# Altium project SmartStepper_21_r1.0.PrjPcb
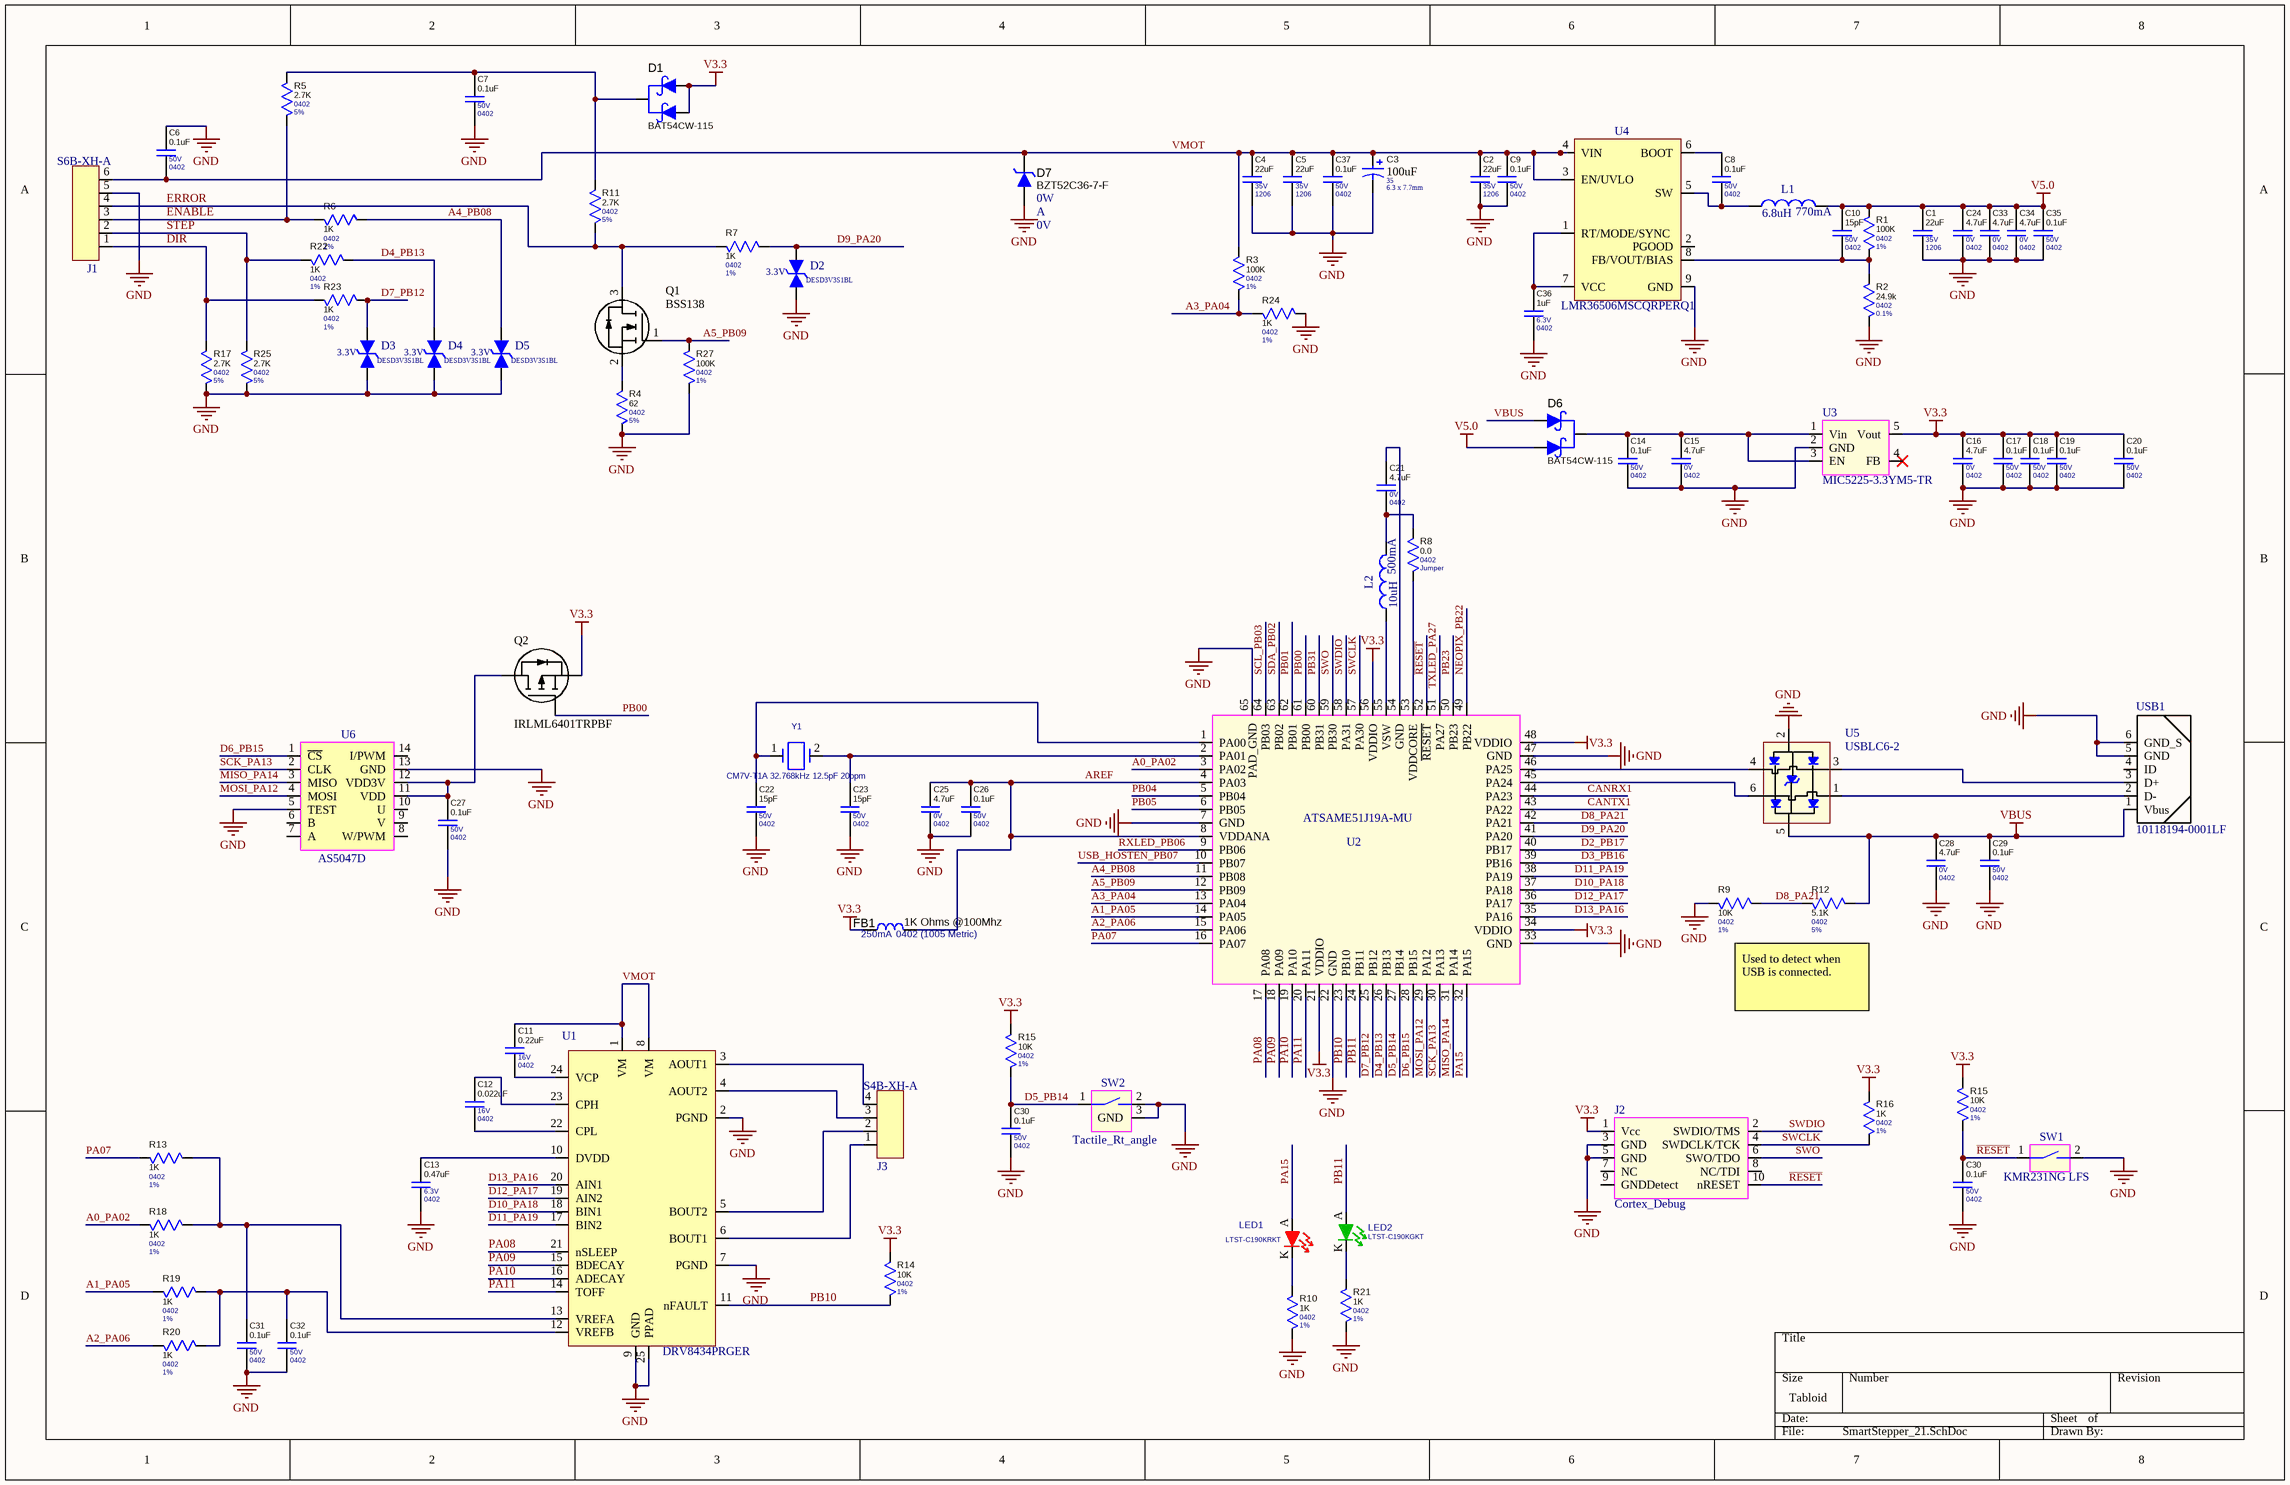
[diagram p0: SmartStepper_21.SchDoc]
1 sheet, 92 parts. Net scope: global (net labels, ports and power ports of the same name join across sheets).
Board files: SmartStepper_21_r1.0.PcbDoc, panel.PcbDoc

## Sheet SmartStepper_21.SchDoc
size Tabloid; PageSetup: Record=PageOptions|CenterHorizontal=True|CenterVertical=True|PrintScale=0.98|XCorrection=1.00|YCorrection=1.00|PrintKind=0|BorderSize=5000000|LeftOffset=0|BottomOffset=0|Orientation=2|PaperLength=1000|PaperWidth=1000|Scale=100|PaperSource=7|PrintQuality=-3|MediaType=1|DitherType=10|PrintScaleMode=1|PaperKind=Tabloid|PaperIndex=3

### Parts
(Parts that share a designator on the sheet are numbered #1, #2 ... from top to bottom, then left to right.)
C1  22uF  Size_Imperial: 1206  Voltage_Str: 35V  [CAP_1206_H]
C2  22uF  Size_Imperial: 1206  Voltage_Str: 35V  [CAP_1206_H]
C3  Size: 6.3 x 7.7mm  Voltage: 35  [UWT1V101MCL1GS]  (hidden comment: 100uF)
C4  22uF  Size_Imperial: 1206  Voltage_Str: 35V  [CAP_1206_H]
C5  22uF  Size_Imperial: 1206  Voltage_Str: 35V  [CAP_1206_H]
C6  0.1uF  Size_Imperial: 0402  Voltage_Str: 50V  [CAP_0402_H]
C7  0.1uF  Size_Imperial: 0402  Voltage_Str: 50V  [CAP_0402_H]
C8  0.1uF  Size_Imperial: 0402  Voltage_Str: 50V  [CAP_0402_H]
C9  0.1uF  Size_Imperial: 0402  Voltage_Str: 50V  [CAP_0402_H]
C10  15pF  Size_Imperial: 0402  Voltage_Str: 50V  [CAP_0402_H]
C11  0.22uF  Size_Imperial: 0402  Voltage_Str: 16V  [CAP_0402_H]
C12  0.022uF  Size_Imperial: 0402  Voltage_Str: 16V  [CAP_0402_H]
C13  0.47uF  Size_Imperial: 0402  Voltage_Str: 6.3V  [CAP_0402_H]
C14  0.1uF  Size_Imperial: 0402  Voltage_Str: 50V  [CAP_0402_H]
C15  4.7uF  Size_Imperial: 0402  Voltage_Str: 0V  [CAP_0402_H]
C16  4.7uF  Size_Imperial: 0402  Voltage_Str: 0V  [CAP_0402_H]
C17  0.1uF  Size_Imperial: 0402  Voltage_Str: 50V  [CAP_0402_H]
C18  0.1uF  Size_Imperial: 0402  Voltage_Str: 50V  [CAP_0402_H]
C19  0.1uF  Size_Imperial: 0402  Voltage_Str: 50V  [CAP_0402_H]
C20  0.1uF  Size_Imperial: 0402  Voltage_Str: 50V  [CAP_0402_H]
C21  4.7uF  Size_Imperial: 0402  Voltage_Str: 0V  [CAP_0402_H]
C22  15pF  Size_Imperial: 0402  Voltage_Str: 50V  [CAP_0402_H]
C23  15pF  Size_Imperial: 0402  Voltage_Str: 50V  [CAP_0402_H]
C24  4.7uF  Size_Imperial: 0402  Voltage_Str: 0V  [CAP_0402_H]
C25  4.7uF  Size_Imperial: 0402  Voltage_Str: 0V  [CAP_0402_H]
C26  0.1uF  Size_Imperial: 0402  Voltage_Str: 50V  [CAP_0402_H]
C27  0.1uF  Size_Imperial: 0402  Voltage_Str: 50V  [CAP_0402_H]
C28  4.7uF  Size_Imperial: 0402  Voltage_Str: 0V  [CAP_0402_H]
C29  0.1uF  Size_Imperial: 0402  Voltage_Str: 50V  [CAP_0402_H]
C30#1  0.1uF  Size_Imperial: 0402  Voltage_Str: 50V  [CAP_0402_H]
C30#2  0.1uF  Size_Imperial: 0402  Voltage_Str: 50V  [CAP_0402_H]
C31  0.1uF  Size_Imperial: 0402  Voltage_Str: 50V  [CAP_0402_H]
C32  0.1uF  Size_Imperial: 0402  Voltage_Str: 50V  [CAP_0402_H]
C33  4.7uF  Size_Imperial: 0402  Voltage_Str: 0V  [CAP_0402_H]
C34  4.7uF  Size_Imperial: 0402  Voltage_Str: 0V  [CAP_0402_H]
C35  0.1uF  Size_Imperial: 0402  Voltage_Str: 50V  [CAP_0402_H]
C36  1uF  Size_Imperial: 0402  Voltage_Str: 6.3V  [CAP_0402_H]
C37  0.1uF  Size_Imperial: 0402  Voltage_Str: 50V  [CAP_0402_H]
D1  BAT54CW-115  [BAT54CW-115]
D2  DESD3V3S1BL  [DESD3V3S1BL]
D3  DESD3V3S1BL  [DESD3V3S1BL]
D4  DESD3V3S1BL  [DESD3V3S1BL]
D5  DESD3V3S1BL  [DESD3V3S1BL]
D6  BAT54CW-115  [BAT54CW-115]
D7  BZT52C36-7-F  Watts_str: 0W  current: A  voltage_str: 0V  [BZT52C36-7-F]
FB1  1K Ohms @100Mhz  Size: 0402 (1005 Metric)  current: 250mA  [IND_0402_H]
J1  S6B-XH-A  [S6B-XH-A]
J2  Cortex_Debug  [FTSH-105-01-L-D]
J3  S4B-XH-A  [S4B-XH-A]
L1  6.8uH  Current: 770mA  [IND_1210_H]
L2  10uH  Current: 500mA  [IND_0805_H]
LED1  LTST-C190KRKT  [LTST-C190KRKT]
LED2  LTST-C190KGKT  [LTST-C190KGKT]
Q1  BSS138  [BSS138]
Q2  IRLML6401TRPBF  [IRLML6401TRPBF_M]
R1  100K  Size_Imperial: 0402  Tolerance: 1%  [RES_0402_H]
R2  24.9k  Size_Imperial: 0402  Tolerance: 0.1%  [RES_0402_H]
R3  100K  Size_Imperial: 0402  Tolerance: 1%  [RES_0402_H]
R4  62  Size_Imperial: 0402  Tolerance: 5%  [RES_0402_H]
R5  2.7K  Size_Imperial: 0402  Tolerance: 5%  [RES_0402_H]
R6  1K  Size_Imperial: 0402  Tolerance: 1%  [RES_0402_H]
R7  1K  Size_Imperial: 0402  Tolerance: 1%  [RES_0402_H]
R8  0.0  Size_Imperial: 0402  Tolerance: Jumper  [RES_0402_H]
R9  10K  Size_Imperial: 0402  Tolerance: 1%  [RES_0402_H]
R10  1K  Size_Imperial: 0402  Tolerance: 1%  [RES_0402_H]
R11  2.7K  Size_Imperial: 0402  Tolerance: 5%  [RES_0402_H]
R12  5.1K  Size_Imperial: 0402  Tolerance: 5%  [RES_0402_H]
R13  1K  Size_Imperial: 0402  Tolerance: 1%  [RES_0402_H]
R14  10K  Size_Imperial: 0402  Tolerance: 1%  [RES_0402_H]
R15#1  10K  Size_Imperial: 0402  Tolerance: 1%  [RES_0402_H]
R15#2  10K  Size_Imperial: 0402  Tolerance: 1%  [RES_0402_H]
R16  1K  Size_Imperial: 0402  Tolerance: 1%  [RES_0402_H]
R17  2.7K  Size_Imperial: 0402  Tolerance: 5%  [RES_0402_H]
R18  1K  Size_Imperial: 0402  Tolerance: 1%  [RES_0402_H]
R19  1K  Size_Imperial: 0402  Tolerance: 1%  [RES_0402_H]
R20  1K  Size_Imperial: 0402  Tolerance: 1%  [RES_0402_H]
R21  1K  Size_Imperial: 0402  Tolerance: 1%  [RES_0402_H]
R22  1K  Size_Imperial: 0402  Tolerance: 1%  [RES_0402_H]
R23  1K  Size_Imperial: 0402  Tolerance: 1%  [RES_0402_H]
R24  1K  Size_Imperial: 0402  Tolerance: 1%  [RES_0402_H]
R25  2.7K  Size_Imperial: 0402  Tolerance: 5%  [RES_0402_H]
R27  100K  Size_Imperial: 0402  Tolerance: 1%  [RES_0402_H]
SW1  KMR231NG LFS  [KMR231NG_LFS]
SW2  Tactile_Rt_angle  [Tactile_Rt_angle]
U1  DRV8434PRGER  [DRV8434PRGER]
U2  ATSAME51J19A-MU  [ATSAME51J19A-MU]
U3  MIC5225-3.3YM5-TR  [MIC5225-3.3YM5-TR]
U4  LMR36506MSCQRPERQ1  [LMR36506MSCQRPERQ1]
U5  USBLC6-2  [USBLC6-2SC6]
U6  AS5047D  [AS5047D]
USB1  10118194-0001LF  [10118194-0001LF]
Y1  CM7V-T1A 32.768kHz 12.5pF 20ppm  [FC-135-32.7680KA-A3]

### Nets
GND: C1.2 C2.2 C3.2(Neg) C4.2 C5.2 C6.1 C7.2 C9.2 C13.2 C14.2 C15.2 C16.2 C17.2 C18.2 C19.2 C20.2 C22.2 C23.2 C24.2 C25.2 C26.2 C27.2 C28.2 C29.2 C30#1.2 C30#2.2 C31.2 C32.2 C33.2 C34.2 C35.2 C36.2 C37.2 D2.1 D3.1 D4.1 D5.1 D7.A J1.5 J2.3(GND) J2.5(GND) R2.1 R4.1 R9.1 R10.1 R17.1 R21.1 R24.2 R25.1 R27.1 SW1.2 SW2.2 SW2.3(GND) U1.2(PGND) U1.7(PGND) U1.9(GND) U1.25(PPAD) U2.7(GND) U2.22(GND) U2.33(GND) U2.47(GND) U2.65(PAD_GND) U3.2(GND) U4.9(GND) U5.2(GND) U6.5(TEST) U6.13(GND) USB1.5(GND) USB1.6(GND_S)
V3.3: C16.1 C17.1 C18.1 C19.1 C20.1 D1.1 D1.2 FB1.1 J2.1(Vcc) Q2.2 R14.1 R15#1.2 R15#2.2 R16.2 U2.21(VDDIO) U2.34(VDDIO) U2.48(VDDIO) U2.56(VDDIO) U3.5(Vout)
V5.0: C1.1 C10.1 C24.1 C33.1 C34.1 C35.1 D6.2 L1.2 R1.2
VBUS: C28.1 C29.1 D6.1 R12.2 U5.5(VBUS) USB1.1(Vbus)
~{RESET}: C30#2.1 J2.10(nRESET) R15#2.1 SW1.1 U2.52(~{RESET})
A0_PA02: R18.1 U2.3(PA02)
A1_PA05: R19.1 U2.14(PA05)
A2_PA06: R20.1 U2.15(PA06)
A3_PA04: R3.1 R24.1 U2.13(PA04)
A4_PB08: D5.2 R6.2 U2.11(PB08)
A5_PB09: Q1.1 R27.2 U2.12(PB09)
AREF: C25.1 C26.1 FB1.2 U2.4(PA03) U2.8(VDDANA)
CANRX1: U2.44(PA23)
CANTX1: U2.43(PA22)
D2_PB17: U2.40(PB17)
D3_PB16: U2.39(PB16)
D4_PB13: D4.2 R22.2 U2.26(PB13)
D5_PB14: C30#1.1 R15#1.1 SW2.1 U2.27(PB14)
D6_PB15: U2.28(PB15) U6.1(~{CS})
D7_PB12: D3.2 R23.2 U2.25(PB12)
D8_PA21: R9.2 R12.1 U2.42(PA21)
D9_PA20: D2.2 R7.2 U2.41(PA20)
D10_PA18: U1.18(BIN1) U2.37(PA18)
D11_PA19: U1.17(BIN2) U2.38(PA19)
D12_PA17: U1.19(AIN2) U2.36(PA17)
D13_PA16: U1.20(AIN1) U2.35(PA16)
DIR: J1.1 R17.2 R23.1
ENABLE: J1.3 R5.1 R6.1
ERROR: J1.4 Q1.3 R7.1 R11.1
MISO_PA14: U2.31(PA14) U6.3(MISO)
MOSI_PA12: U2.29(PA12) U6.4(MOSI)
NEOPIX_PB22: U2.49(PB22)
PA07: R13.1 U2.16(PA07)
PA08: U1.21(nSLEEP) U2.17(PA08)
PA09: U1.15(BDECAY) U2.18(PA09)
PA10: U1.16(ADECAY) U2.19(PA10)
PA11: U1.14(TOFF) U2.20(PA11)
PA15: LED1.A U2.32(PA15)
PB00: Q2.1 U2.61(PB00)
PB01: U2.62(PB01)
PB04: U2.5(PB04)
PB05: U2.6(PB05)
PB10: R14.2 U1.11(nFAULT) U2.23(PB10)
PB11: LED2.A U2.24(PB11)
PB23: U2.50(PB23)
PB31: U2.60(PB31)
RXLED_PB06: U2.9(PB06)
SCK_PA13: U2.30(PA13) U6.2(CLK)
SCL_PB03: U2.64(PB03)
SDA_PB02: U2.63(PB02)
STEP: J1.2 R22.1 R25.2
SWCLK: J2.4(SWDCLK/TCK) R16.1 U2.57(PA30)
SWDIO: J2.2(SWDIO/TMS) U2.58(PA31)
SWO: J2.6(SWO/TDO) U2.59(PB30)
TXLED_PA27: U2.51(PA27)
USB_HOSTEN_PB07: U2.10(PB07)
VMOT: C2.1 C3.1(Pos) C4.1 C5.1 C6.2 C9.1 C11.1 C37.1 D7.K J1.6 R3.2 U1.1(VM) U1.8(VM) U4.3(EN/UVLO) U4.4(VIN)
NetC7_1: C7.1 D1.3 R5.2 R11.2
NetC8_1: C8.1 U4.6(BOOT)
NetC8_2: C8.2 L1.1 U4.5(SW)
NetC10_2: C10.2 R1.1 R2.2 U4.8(FB/VOUT/BIAS)
NetC11_2: C11.2 U1.24(VCP)
NetC12_1: C12.1 U1.23(CPH)
NetC12_2: C12.2 U1.22(CPL)
NetC13_1: C13.1 U1.10(DVDD)
NetC14_1: C14.1 C15.1 D6.3 U3.1(Vin) U3.3(EN)
NetC21_1: C21.1 U2.54(GND)
NetC21_2: C21.2 L2.2 R8.2
NetC22_1: C22.1 U2.1(PA00) Y1.1(A)
NetC23_1: C23.1 U2.2(PA01) Y1.2(B)
NetC27_1: C27.1 Q2.3 U6.11(VDD) U6.12(VDD3V)
NetC31_1: C31.1 R13.2 R18.2 U1.13(VREFA)
NetC32_1: C32.1 R19.2 R20.2 U1.12(VREFB)
NetC36_1: C36.1 U4.1(RT/MODE/SYNC) U4.7(VCC)
NetJ3_1: J3.1 U1.6(BOUT1)
NetJ3_2: J3.2 U1.5(BOUT2)
NetJ3_3: J3.3 U1.4(AOUT2)
NetJ3_4: J3.4 U1.3(AOUT1)
NetL2_1: L2.1 U2.55(VSW)
NetLED1_K: LED1.K R10.2
NetLED2_K: LED2.K R21.2
NetQ1_2: Q1.2 R4.2
NetR8_1: R8.1 U2.53(VDDCORE)
NetU2_45: U2.45(PA24) U5.6(IO1)
NetU2_46: U2.46(PA25) U5.4(IO2)
NetU5_1: U5.1(IO1) USB1.2(D-)
NetU5_3: U5.3(IO2) USB1.3(D+)

Not connected (* = marked no-connect by the designer): J2 7(NC) 8(NC/TDI) 9(GNDDetect); U3 4(FB)*; U4 2(PGOOD); U6 6(B) 7(A) 8(W/PWM) 9(V) 10(U) 14(I/PWM); USB1 4(ID)

### Notes on the sheet
- Used to detect when USB is connected.
- (in symbol altiumdb561d376dcaa1e7.492460921) 3.3V

### Library data of the parts
C1 C2 C4 C5 = altiumdb4f4e676cee2d25.37975462: CAP CER 22UF 35V 20% X5R 1206; Manufacturer: TDK Corporation; Manufacture_Parts: TDK Corporation:C3216X5R1V226M; Vendor_Part_Number: 445-8045-1-ND; ID: 16; Farad: 2.2E-5; Operating_Temp: -55Â°C ~ 85Â°C; Component: C3216X5R1V226M; Misfit Price: 0; Vendor: Digikey; Vendor_Qty_Avail: 5703; High_Price: 0.319; Low_Price: 0.267; Size_Metric: 3216; Watts_Str: 0W; Current_Str: A; Vendor_Unit_Price: 1.24; Vendor_Packaging: Cut Tape (CT); Value: 22uF; Company_Part_GUID: altiumdb4f4e676cee2d25.37975462; Voltage: 35V; Size: 1206 (3216 Metric); Tolerance: 20%; Temp_Coeff: X5R; Manufacturer_Part_Number: C3216X5R1V226M; Created_Date: 2/29/2012; ComponentLink1Description: Digikey; ComponentLink2Description: Datasheet; ComponentLink1URL: http://search.digikey.com/us/en/products/C3216X5R1V226M/445-8045-1-ND/2792165; ComponentLink2URL: http://www.tdk.com/pdf/general_B11.pdf; Vendor_Part_URL: http://search.digikey.com/us/en/products/C3216X5R1V226M/445-8045-1-ND/2792165; Vendor_Update_Date: 4/26/2012; Watts: 0; Price: 0.267; Vendor_Part_GUID: altiumdb4f4e675de96ab8.73927878
C3 = altiumdb57a880e8344183.38641875: 100uF 35V SMD; Manufacture_Parts: :UWT1V101MCL1GS; ID: 15; Farad: 0; Tolerance: 20%; Vendor: unknown; Watts_Str: 0W; Current_Str: A; value: 100uF; Company_Part_GUID: altiumdb57a880e8344183.38641875; Component: UWT1V101MCL1GS; Manufacturer_Part_Number: UWT1V101MCL1GS; ComponentLink1Description: unknown; ComponentLink2Description: Datasheet; Misfit Price: 0; Size_Imperial: 6.3 x 7.7mm; Size_Metric: 6.3 x 7.7mm; Voltage_Str: 35V; Watts: 0; Price: 0
C6-C9 C14 C17-C20 C26 C27 C29 C30#1 C30#2 C31 C32 C35 C37 = altiumdb4f04b43ed29fe8.21172567: CAP CER 0.1UF 50V 10% X7R 0402; Manufacturer: TDK Corporation; Misfit Part Number: 00012-001-06580; Manufacture_Parts: TDK Corporation:CGA2B3X7R1H104K; Vendor_Part_Number: 445-6899-2-ND; ID: 75; Voltage: 50; Farad: 1E-7; Operating_Temp: -55Â°C ~ 125Â°C; Component: CGA2B3X7R1H104K; Misfit Price: 0; Vendor: Digikey; Vendor_Qty_Avail: 10000; High_Price: 0.022; Low_Price: 0.015; Size_Metric: 1005; Watts_Str: 0W; Current_Str: A; Vendor_Unit_Price: 0.16; Value: 0.1uF; Company_Part_GUID: altiumdb4f04b43ed29fe8.21172567; Size: 0402 (1005 Metric); Tolerance: 10%; Temp_Coeff: X7R; Manufacturer_Part_Number: CGA2B3X7R1H104K; Created_Date: 1/4/2012; ComponentLink1Description: Digikey; ComponentLink2Description: Datasheet; ComponentLink1URL: http://search.digikey.com/us/en/products/CGA2B3X7R1H104K/445-6899-2-ND/2672792; ComponentLink2URL: http://www.tdk.com/pdf/automotive_B11.pdf; Vendor_Part_URL: http://search.digikey.com/us/en/products/CGA2B3X7R1H104K/445-6899-2-ND/2672792; Vendor_Update_Date: 1/4/2012; Watts: 0; Price: 0.015
C10 C22 C23 = altiumdb4ee8ad945622b4.06854484: CAP 0402 CER 15PF 50V C0G 5%; Manufacturer_Part_Number: C0402C150J5GACTU; Manufacturer: Kemet; Misfit Part Number: 00012-001-06515; Old Part Number: 5110-0201-00; Manufacture_Parts: AVX:04025A150JAT2A / VISHAY:VJ0402A150JXACW1BC / Kemet:C0402C150J5GACTU; Vendor_Part_Number: 399-1014-1-ND; ID: 21; Voltage: 50; Farad: 1.5E-11; Temp_Coeff: C0G (NP0); Operating_Temp: - 55 C to + 125 C; Component: 04025A150JAT2A; Misfit Price: 0; Vendor: Digikey; Vendor_Qty_Avail: 182357; High_Price: 0.12; Low_Price: 0.013; Size_Metric: 1005; Watts_Str: W; Current_Str: A; Vendor_Unit_Price: 0.04; Value: 15pF; Company_Part_GUID: altiumdb4ee8ad945622b4.06854484; Size: 0402 (1005 metric); Tolerance: 5 %; Created_Date: 12/14/2011; ComponentLink1Description: Mouser; ComponentLink2Description: Datasheet; ComponentLink1URL: http://search.digikey.com/us/en/products/C0402C150J5GACTU/399-1014-1-ND/411289; ComponentLink2URL: http://www.avx.com/docs/Catalogs/ccog.pdf; Vendor_Part_URL: http://search.digikey.com/us/en/products/C0402C150J5GACTU/399-1014-1-ND/411289; Vendor_Update_Date: 4/26/2012; Price: 0.013
C11 = altiumdb4ee8ae3ea498a8.40726587: CAP 0402 CER 220NF 16V X7R 10%; Manufacturer_Part_Number: C1005X7R1C224K; Manufacturer: TDK Corporation; Misfit Part Number: 00012-001-06517; Manufacture_Parts: Murata Electronics North America:GRM155R71C224KA12D / TDK Corporation:C1005X7R1C224K; Vendor_Part_Number: 445-5936-1-ND; ID: 36; Voltage: 16; Farad: 2.2E-7; Operating_Temp: -55Â°C ~ 125Â°C; Component: GRM155R71C224KA12D; Misfit Price: 0; Vendor: Digikey; Vendor_Qty_Avail: 67449; High_Price: 0.015; Low_Price: 0.01; Size_Metric: 1005; Watts_Str: W; Current_Str: A; Vendor_Unit_Price: 0.15; Value: 0.22uF; Company_Part_GUID: altiumdb4ee8ae3ea498a8.40726587; Size: 0402 (1005 Metric); Tolerance: 10%; Temp_Coeff: X7R; Created_Date: 12/14/2011; ComponentLink1Description: Digikey; ComponentLink2Description: Datasheet; ComponentLink1URL: http://search.digikey.com/us/en/products/C1005X7R1C224K/445-5936-1-ND/2443976; ComponentLink2URL: http://search.murata.co.jp/Ceramy/image/img/PDF/ENG/GRM155R71C224KA12.pdf; Vendor_Part_URL: http://search.digikey.com/us/en/products/C1005X7R1C224K/445-5936-1-ND/2443976; Vendor_Update_Date: 4/26/2012; Price: 0.01
C12 = altiumdb4ee8ac51866a41.07748777: CAP 0402 CER .022UF 16V X7R 10%; Manufacturer_Part_Number: C0402C223K4RACTU; Manufacturer: Kemet; Misfit Part Number: 00012-001-06365; Manufacture_Parts: AVX:0402YC223KAT2A / Kemet:C0402C223K4RACTU / Murata Electronics North America:GRM155R71C223KA01D / Panasonic - ECG:ECJ-0EF1E223Z; Vendor_Part_Number: 399-3518-1-ND; ID: 1; Voltage: 16; Farad: 2.2E-8; Operating_Temp: - 55 C to + 125 C; Component: 0402YC223KAT2A; Misfit Price: 0; Vendor: Digikey; Vendor_Qty_Avail: 25844; High_Price: 0.2; Low_Price: 0.018; Size_Metric: 1005; Watts_Str: W; Current_Str: A; Vendor_Unit_Price: 0.37; Value: 0.022uF; Company_Part_GUID: altiumdb4ee8ac51866a41.07748777; Size: 0402 (1005 metric); Tolerance: 10 %; Temp_Coeff: X7R; Created_Date: 12/14/2011; ComponentLink1Description: Mouser; ComponentLink2Description: Datasheet; ComponentLink1URL: http://search.digikey.com/us/en/products/C0402C223K4RACTU/399-3518-1-ND/789658; ComponentLink2URL: http://avx.com/docs/Catalogs/cx7r.pdf; Vendor_Part_URL: http://search.digikey.com/us/en/products/C0402C223K4RACTU/399-3518-1-ND/789658; Vendor_Update_Date: 4/26/2012; Price: 0.018
C13 = altiumdb4ee8aefd8a9d96.75333611: CAP 0402 CER 470NF 6.3V X5R 10%; Manufacturer: Kemet; Misfit Part Number: 00012-001-06393; Manufacture_Parts: Kemet:C0402C474K9PACTU / AVX:04026D474KAT2A / Murata:GRM155R60J474KE19D; Vendor_Part_Number: 399-4899-2-ND; ID: 59; Voltage: 6.3; Farad: 4.7E-7; Operating_Temp: -55Â°C ~ 85Â°C; Component: C0402C474K9PACTU; Misfit Price: 0; Vendor: Digikey; Vendor_Qty_Avail: 50000; High_Price: 0.018; Low_Price: 0.01227; Size_Metric: 1005; Watts_Str: 0W; Current_Str: A; Vendor_Unit_Price: 0.17; Value: 0.47uF; Company_Part_GUID: altiumdb4ee8aefd8a9d96.75333611; Size: 0402 (1005 Metric); Tolerance: 10%; Temp_Coeff: X5R; Manufacturer_Part_Number: C0402C474K9PACTU; Created_Date: 12/14/2011; ComponentLink1Description: Digikey; ComponentLink2Description: Datasheet; ComponentLink1URL: http://search.digikey.com/us/en/products/GRM155R60J474KE19D/490-3266-2-ND/702530; ComponentLink2URL: http://search.murata.co.jp/Ceramy/image/img/PDF/ENG/GRM155R60J474KE19.pdf; Vendor_Part_URL: http://search.digikey.com/us/en/products/C0402C474K9PACTU/399-4899-2-ND/1090804; Vendor_Update_Date: 12/14/2011; Watts: 0; Price: 0.01227
C15 C16 C21 C24 C25 C28 C33 C34 = altiumdb4ee8aef7c8e199.98927270: CAP 0402 CER 4.7UF 6.3V X5R 20%; Manufacturer: TDK Corporation; Misfit Part Number: 00012-001-06445; Manufacture_Parts: TDK Corporation:C1005X5R0J475K / TDK:C1005X5R0J475M-T / Panasonic - ECG:ECJ-0EB0J475M / YAGEO:CC0402MRX5R5BB475 / Murata Electronics North America:GRM155R60J475ME87D; Vendor_Part_Number: 445-5947-1-ND; ID: 58; Voltage: 0; Farad: 4.7E-6; Tolerance: 10%; Operating_Temp: -55Â°C ~ 85Â°C; Component: C1005X5R0J475K; Vendor: Digikey; Vendor_Qty_Avail: 27434; High_Price: 0.4; Low_Price: 0.095; Size_Metric: 1005; Watts_Str: 0W; Current_Str: A; Vendor_Packaging: Cut Tape (CT); Value: 4.7uF; Company_Part_GUID: altiumdb4ee8aef7c8e199.98927270; Size: 0402 (1005 Metric); Temp_Coeff: X5R; Manufacturer_Part_Number: C1005X5R0J475K; Created_Date: 4/27/2012; ComponentLink1Description: Digikey; ComponentLink2Description: Datasheet; ComponentLink1URL: http://search.digikey.com/us/en/products/C1005X5R0J475K/445-5947-1-ND/2443987; ComponentLink2URL: http://www.murata.com/products/catalog/pdf/c02e.pdf; Misfit Price: 0; Vendor_Part_URL: http://search.digikey.com/us/en/products/C1005X5R0J475K/445-5947-1-ND/2443987; Vendor_Update_Date: 4/27/2012; Watts: 0; Price: 0.095; Vendor_Unit_Price: 0.4; Vendor_Part_GUID: altiumdb4f9a7fee84f918.39562992
C36 = altiumdb4ee8add109f026.16536860: CAP 0402 CER 1UF 6.3V X5R 20%; Manufacturer_Part_Number: JMK105BJ105MV-F; Manufacturer: Taiyo Yuden; Misfit Part Number: 00012-001-06314; Manufacture_Parts: AVX:04026D105MAT2A / Kemet:C0402C105M9PACTU / Taiyo Yuden:JMK105BJ105MV-F / TDK Corporation:C1005X5R0J105M / MURATA:GRM155R60J105MA01; Vendor_Part_Number: 587-2714-1-ND; ID: 26; Voltage: 6.3; Farad: 1E-6; Operating_Temp: - 55 C to + 85 C; Component: 04026D105MAT2A; Misfit Price: 0; Vendor: Digikey; Vendor_Qty_Avail: 58300; High_Price: 0.4; Low_Price: 0.048; Size_Metric: 1005; Watts_Str: W; Current_Str: A; Vendor_Unit_Price: 0.22; Value: 1uF; Company_Part_GUID: altiumdb4ee8add109f026.16536860; Size: 0402 (1005 metric); Tolerance: 20 %; Temp_Coeff: X5R; Created_Date: 12/14/2011; ComponentLink1Description: Mouser; ComponentLink2Description: Datasheet; ComponentLink1URL: http://search.digikey.com/us/en/products/JMK105BJ105MV-F/587-2714-1-ND/2417301; ComponentLink2URL: http://www.avx.com/docs/Catalogs/cx5r.pdf; Vendor_Part_URL: http://search.digikey.com/us/en/products/JMK105BJ105MV-F/587-2714-1-ND/2417301; Vendor_Update_Date: 4/26/2012; Price: 0.048
D1 D6 = altiumdb4f3d2026485e48.01358799: DIODE SCHOTTKY 30V DL CC SOT323 200mA; Manufacturer: NXP Semiconductors; Misfit Part Number: 00013-203-00195; Manufacture_Parts: NXP Semiconductors:BAT54CW,115; Vendor_Part_Number: 568-1613-2-ND; ID: 11; Component: BAT54CW,115; Misfit Price: 0; Vendor: Digikey; Vendor_Qty_Avail: 21000; High_Price: 0.049; Low_Price: 0.028; Size_Imperial: SC-70, SOT-323; Voltage_Str: 0V; Watts_Str: 0W; Current: 0.2; Current_Str: 0.2A; Vendor_Unit_Price: 0.3; Vendor_Packaging: Cut Tape (CT); Company_Part_GUID: altiumdb4f3d2026485e48.01358799; Manufacturer_Part_Number: BAT54CW,115; Created_Date: 2/16/2012; ComponentLink1Description: Digikey; ComponentLink2Description: Datasheet; ComponentLink1URL: http://search.digikey.com/us/en/products/BAT54CW,115/568-1613-2-ND/763217; ComponentLink2URL: http://www.nxp.com/documents/data_sheet/BAT54W.pdf; Vendor_Part_URL: http://search.digikey.com/us/en/products/BAT54CW,115/568-1613-2-ND/763217; Vendor_Update_Date: 2/16/2012; Size: SC-70, SOT-323; Size_Metric: SC-70, SOT-323; Voltage: 0; Watts: 0; Price: 0.028; Vendor_Part_GUID: altiumdb4f3d1fdeb51ae7.34376329
D2-D5 = altiumdb561d376dcaa1e7.492460921: 3.3V TVS, Vbr 3.8Vmax 35W peak; Manufacture_Parts: Diodes:DESD3V3S1BL-7B; ID: 13; Misfit Price: 0; Vendor: unknown; Voltage_Str: 0V; Watts_Str: 0W; Current_Str: A; Company_Part_GUID: altiumdb561d376dcaa1e7.492460921; Component: DESD3V3S1BL; Manufacturer_Part_Number: DESD3V3S1BL; ComponentLink1Description: unknown; ComponentLink2Description: Datasheet; Voltage: 0; Watts: 0; Price: 0
D7 = altiumdb550480a1624ae8.73528114: DIODE ZENER 36V 500MW SOD123; Manufacturer: Diodes Incorporated; Manufacture_Parts: Diodes Incorporated:BZT52C36-7-F; Vendor_Part_Number: BZT52C36-FDIDKR-ND; ID: 30; Misfit Price: 0; Vendor: Digikey; High_Price: 0.21; Low_Price: 0.03945; Size_Imperial: SOD-123; Company_Part_GUID: altiumdb550480a1624ae8.73528114; Component: BZT52C36-7-F; Manufacturer_Part_Number: BZT52C36-7-F; Created_Date: 3/14/2015; ComponentLink1Description: Digikey; ComponentLink2Description: Datasheet; ComponentLink1URL: http://www.digikey.com/product-detail/en/BZT52C36-7-F/BZT52C36-FDIDKR-ND/1837494; ComponentLink2URL: http://www.diodes.com/datasheets/ds18004.pdf; Vendor_Part_URL: http://www.digikey.com/product-detail/en/BZT52C36-7-F/BZT52C36-FDIDKR-ND/1837494; Vendor_Update_Date: 3/14/2015; Size: SOD-123; Size_Metric: SOD-123; Voltage: 0; Watts: 0; Current_Str: A; Price: 0.03945
FB1 = altiumdb4f060841b33011.93301124: FILTER CHIP 1000 OHM 250MA 0402; Manufacturer: Murata Electronics North America; Misfit Part Number: 00012-001-12284; Manufacture_Parts: Murata Electronics North America:BLM15HG102SN1D; Vendor_Part_Number: 490-3999-2-ND; ID: 1; Misfit Price: 0; Vendor: Digikey; Vendor_Qty_Avail: 790000; High_Price: 0.066; Low_Price: 0.05; Size_Imperial: 0402; Size_Metric: 1005; Voltage_Str: 0V; Watts_Str: 0W; Vendor_Unit_Price: 0.42; Vendor_Packaging: Cut Tape (CT); Company_Part_GUID: altiumdb4f060841b33011.93301124; Component: BLM15HG102SN1D; Manufacturer_Part_Number: BLM15HG102SN1D; Created_Date: 1/5/2012; ComponentLink1Description: Digikey; ComponentLink2Description: Datasheet; ComponentLink1URL: http://search.digikey.com/us/en/products/BLM15HG102SN1D/490-3999-2-ND/1016158; ComponentLink2URL: http://search.murata.co.jp/Ceramy/image/img/PDF/ENG/L0110S0101BLM15H.pdf; Vendor_Part_URL: http://search.digikey.com/us/en/products/BLM15HG102SN1D/490-3999-2-ND/1016158; Vendor_Update_Date: 1/5/2012; Value: 1K Ohms @100Mhz; Voltage: 0; Watts: 0; Current_Str: 250mA; Price: 0.05; Vendor_Part_GUID: altiumdb4f0606d6c23c91.06087637
J1 = altiumdb4fe36c890d3cd8.36371586: CONN HEADER R/A 6POS 2.5MM; Manufacturer: JST; Manufacture_Parts: JST:S4B-XH-A; ID: 130; Misfit Price: 0; Vendor_Qty_Avail: 2389; High_Price: 0.88; Low_Price: 0.5489; Voltage_Str: 0V; Watts_Str: 0W; Current_Str: A; Vendor_Packaging: Cut Tape (CT); Company_Part_GUID: altiumdb4fe36c890d3cd8.36371586; Component: S6B-XH-A; Manufacturer_Part_Number: S6B-XH-A; Created_Date: 6/21/2012; Vendor_Update_Date: 6/21/2012; Voltage: 0; Watts: 0; Price: 0.5489
J2 = altiumdb4feb1a682396d4.11944837: CONN HEADER 10POS DUAL .05&quot; T/H; Manufacturer: Samtec Inc; Manufacture_Parts: Samtec Inc:FTSH-105-01-L-D; Vendor_Part_Number: FTSH-105-01-L-D-ND; ID: 24; Misfit Price: 0; Vendor: Digikey; Vendor_Qty_Avail: 269; High_Price: 1.68; Voltage_Str: 0V; Watts_Str: 0W; Current_Str: A; Vendor_Packaging: Tube; Company_Part_GUID: altiumdb4feb1a682396d4.11944837; Component: Cortex_Debug; Manufacturer_Part_Number: FTSH-105-01-L-D; Created_Date: 6/27/2012; ComponentLink1Description: Digikey; ComponentLink2Description: Datasheet; ComponentLink1URL: http://search.digikey.com/product-detail/en/FTSH-105-01-L-D/FTSH-105-01-L-D-ND/2649978; ComponentLink2URL: http://www.samtec.com/documents/webfiles/cpdf/FTSH-1XX-XX-XXX-D-XX-MKT.pdf; Vendor_Part_URL: http://search.digikey.com/product-detail/en/FTSH-105-01-L-D/FTSH-105-01-L-D-ND/2649978; Vendor_Update_Date: 6/27/2012; Low_Price: 1.68; Voltage: 0; Watts: 0; Price: 1.68
J3 = altiumdb4fe36c890d3cd8.3637158: CONN HEADER R/A 4POS 2.5MM; Manufacturer: JST; Manufacture_Parts: JST:S4B-XH-A; ID: 122; Misfit Price: 0; Vendor_Qty_Avail: 2389; High_Price: 0.88; Low_Price: 0.5489; Voltage_Str: 0V; Watts_Str: 0W; Current_Str: A; Vendor_Packaging: Cut Tape (CT); Company_Part_GUID: altiumdb4fe36c890d3cd8.3637158; Component: S4B-XH-A; Manufacturer_Part_Number: S4B-XH-A; Created_Date: 6/21/2012; Vendor_Update_Date: 6/21/2012; Voltage: 0; Watts: 0; Price: 0.5489
L1 = I1210_1: FIXED IND 6.8UH 940MA 156 MOHM; Vendor_Part_Number: CBC3225T6R8MR; Manufacturer: Taiyo Yuden; Manufacture_Parts: Taiyo Yuden:CBC3225T6R8MR; ComponentField6: Published 8-Jun-2000; ID: 1; Henry: 6.8E-6; Vendor_Qty_Avail: 54000; High_Price: 1.5; Low_Price: 0.54; Misfit Price: 0; OriginalName: INDUCTOR; Value: 6.8uH; Company_Part_GUID: I1210_1; Size: 1210; Vendor_Update_Date: 1/8/2012; Manufacturer_Part_Number: CBC3225T6R8MR; Created_Date: 10/12/2020; Price: 1; Vendor_Unit_Price: 0.54
L2 = altiumdb5c90db60243792.81713547: FIXED IND 10UH 500MA 300 MOHM; Manufacturer: TDK Corporation; Manufacture_Parts: TDK Corporation:MLZ2012N100LT000; ComponentField6: Published 8-Jun-2000; ID: 1; Henry: 1E-5; Type: Multilayer; Shielding: Shielded; Frequency_Self_Resonant: 50MHz; Operating_Temp: -55C ~ 125C; Component: MLZ2012N100LT000; Misfit Price: 0; Vendor: Digikey; Size_Imperial: 0805; Size_Metric: 2012; Vendor_Packaging: ISARRAY:0=Digi-Reel%C2%AE%C2%A0&1=javascript%3AdlgHelp%28%27en%27%2C%27Standard%2520Packaging%2520Help%27%29; Voltage_Str: 0V; Current_Str: A; Watts_Str: 0W; OriginalName: INDUCTOR; Value: 10uH; Company_Part_GUID: altiumdb5c90db60243792.81713547; Size: 0805 (2012 Metric); DC_Resistance: 300 mOhm; Q_Freq: -; Manufacturer_Part_Number: MLZ2012N100LT000; ComponentLink1Description: Digikey; ComponentLink2Description: Datasheet; Voltage: 0; Watts: 0; Price: 0
LED1 = altiumdb4f59f5b2e3b411.05953718: LED SUPER RED CLEAR 0603 SMD 20mA Vf=2V; Manufacturer: Lite-On Inc; Manufacture_Parts: Lite-On Inc:LTST-C190KRKT; Vendor_Part_Number: 160-1436-1-ND; ID: 19; Misfit Price: 0; Vendor: Digikey; Vendor_Qty_Avail: 25660; High_Price: 0.054; Low_Price: 0.033; Size_Imperial: 0603; Size_Metric: 1608; Voltage_Str: 0V; Watts_Str: 0W; Current_Str: A; Vendor_Unit_Price: 0.41; Vendor_Packaging: Cut Tape (CT); Company_Part_GUID: altiumdb4f59f5b2e3b411.05953718; Component: LTST-C190KRKT; Manufacturer_Part_Number: LTST-C190KRKT; Created_Date: 3/9/2012; ComponentLink1Description: Digikey; ComponentLink2Description: Datasheet; ComponentLink1URL: http://search.digikey.com/us/en/products/LTST-C190KRKT/160-1436-1-ND/386816; ComponentLink2URL: http://optoelectronics.liteon.com/en-us/api/DwonloadFileHandler.ashx?txtSpecNo=DS-22-99-0151&amp;txtPartNo=LTST-C190KRKT; Vendor_Part_URL: http://search.digikey.com/us/en/products/LTST-C190KRKT/160-1436-1-ND/386816; Vendor_Update_Date: 4/26/2012; Size: 0603 (1608 Metric); Voltage: 0; Watts: 0; Price: 0.033; Vendor_Part_GUID: altiumdb4f59f5957738d6.49476478
LED2 = altiumdb52dbbf15aa8d02.61467154: LED GREEN CLEAR 0603 SMD; Manufacturer: Lite-On Inc; Manufacture_Parts: Lite-On Inc:LTST-C190KGKT; Vendor_Part_Number: 160-1435-6-ND; ID: 26; Misfit Price: 0; Vendor: Digikey; High_Price: 0.29; Low_Price: 0.05382; Size_Imperial: 0603; Size_Metric: 1608; Voltage_Str: 0V; Watts_Str: 0W; Current_Str: A; Company_Part_GUID: altiumdb52dbbf15aa8d02.61467154; Component: LTST-C190KGKT; Manufacturer_Part_Number: LTST-C190KGKT; Created_Date: 1/19/2014; ComponentLink1Description: Digikey; ComponentLink2Description: Datasheet; ComponentLink1URL: http://www.digikey.com/product-detail/en/LTST-C190KGKT/160-1435-6-ND/1711626; ComponentLink2URL: http://optoelectronics.liteon.com/upload/download/DS22-2000-074/P_100_ltst-c190kgkt.pdf; Vendor_Part_URL: http://www.digikey.com/product-detail/en/LTST-C190KGKT/160-1435-6-ND/1711626; Vendor_Update_Date: 1/19/2014; Size: 0603 (1608 Metric); Voltage: 0; Watts: 0; Price: 0.05382
Q1 = altiumdb57eceeefb79952.37783215: N-FET SOT23; Manufacturer: ON Semiconductor; Manufacture_Parts: ON Semiconductor:BSS138 / Diodes Incorporated:BSS138TA; Vendor_Part_Number: BSS138CT-ND; ID: 32; Misfit Price: 0; Vendor: Digikey; Voltage_Str: 0V; Watts_Str: 0W; Current_Str: A; Company_Part_GUID: altiumdb57eceeefb79952.37783215; Component: BSS138; Manufacturer_Part_Number: BSS138; ComponentLink1Description: unknown; ComponentLink2Description: Datasheet; Vendor_Part_URL: https://www.digikey.com/product-detail/en/on-semiconductor/BSS138/BSS138CT-ND/244294; Size: SOT23; Size_Imperial: SOT23; Size_Metric: SOT23; Voltage: 0; Watts: 0; Price: 0
Q2 = altiumdb4f097f24c87689.72269489: MOSFET P-CH 12V 4.3A SOT-23; Manufacturer: International Rectifier; Misfit Part Number: 00013-209-00061; Old Part Number: 5805-0112-00; Manufacture_Parts: International Rectifier:IRLML6401TRPBF; Vendor_Part_Number: IRLML6401PBFTR-ND; ID: 2; Misfit Price: 0.0781; Vendor: Digikey; Vendor_Qty_Avail: 54000; High_Price: 0.124; Low_Price: 0.102; Size_Imperial: TO-236-3, SC-59, SOT-23-3; Voltage: 0; Voltage_Str: 0V; Watts_Str: 0W; Current_Str: A; Vendor_Unit_Price: 0.58; Vendor_Packaging: Cut Tape (CT); Company_Part_GUID: altiumdb4f097f24c87689.72269489; Component: IRLML6401TRPBF; Manufacturer_Part_Number: IRLML6401TRPBF; Created_Date: 12/14/2011; ComponentLink1Description: Datasheet; ComponentLink2Description: Digikey; ComponentLink1URL: http://www.irf.com/product-info/datasheets/data/irlml6401pbf.pdf; ComponentLink2URL: http://search.digikey.com/us/en/products/IRLML6401TRPBF/IRLML6401PBFTR-ND/811442; Vendor_Part_URL: http://search.digikey.com/us/en/products/IRLML6401TRPBF/IRLML6401PBFTR-ND/811442; Vendor_Update_Date: 1/8/2012; Size: TO-236-3, SC-59, SOT-23-3; Size_Metric: TO-236-3, SC-59, SOT-23-3; Watts: 0; Price: 0.0781; Vendor_Part_GUID: altiumdb4ee8de13578bb8.73899850
R1 R3 R27 = altiumdb4ee8d8073eed91.89162195: RES 0402 TKF 100K 1% 1/16W; Manufacturer_Part_Number: RC0402FR-07100KL; Manufacturer: Yageo; Misfit Part Number: 00017-124-10065; Manufacture_Parts: Vishay/Dale:CRCW0402100KFKED / KOA:RK73H1ETTP1003F / Panasonic - ECG:ERJ-2RKF1003X / Yageo:RC0402FR-07100KL / Rohm Semiconductor:MCR01MZPF1003; Vendor_Part_Number: 311-100KLRTR-ND; ID: 12; Working_Voltage: 79.37; Watts: 0.063; Ohms: 100000; Component: CRCW0402100KFKED; Misfit Price: 0; Vendor: Digikey; Vendor_Qty_Avail: 870000; High_Price: 0.005; Low_Price: 0.003; Size_Metric: 1005; Voltage_Str: 79.37V; Watts_Str: 0.063W; Current_Str: A; Vendor_Unit_Price: 0.1; Vendor_Packaging: Cut Tape (CT); Company_Part_GUID: altiumdb4ee8d8073eed91.89162195; Value: 100K; Size: 0402 (1005 Metric); Created_Date: 12/14/2011; ComponentLink1Description: Digikey; ComponentLink2Description: Datasheet; ComponentLink1URL: http://search.digikey.com/us/en/products/RC0402FR-07100KL/311-100KLRTR-ND/726526; ComponentLink2URL: http://www.vishay.com/doc?20035; Vendor_Part_URL: http://search.digikey.com/us/en/products/RC0402FR-07100KL/311-100KLRTR-ND/726526; Vendor_Update_Date: 4/26/2012; Price: 0.003; Vendor_Part_GUID: altiumdb4ee8d80eba5c92.19788229
R2 = altiumdb4ee8db9d39bd80.29213325: RES 0402 TKF 24.9k 0.1% 1/16W; Manufacturer: Yageo; Manufacture_Parts: Yageo:RC0402FR-0724K9L; ID: 158; Ohms: 24900; Component: RC0402FR-0724K9L; Misfit Price: 0; Vendor_Qty_Avail: 54710; High_Price: 0.004; Low_Price: 0.002; Size_Metric: 1005; Current_Str: A; Vendor_Unit_Price: 0.012; Vendor_Packaging: Cut Tape (CT); Company_Part_GUID: altiumdb4ee8db9d39bd80.29213325; Value: 24.9k; Size: 0402 (1005 Metric); Manufacturer_Part_Number: RC0402FR-0724K9L; Created_Date: 12/14/2011; Vendor_Update_Date: 4/26/2012; Price: 0.002
R4 = altiumdb4ee8db66171e85.29075115: RES 0402 TKF 62R 5% 1/16W; Manufacturer: Panasonic - ECG; Misfit Part Number: 00017-126-62026; Manufacture_Parts: Panasonic - ECG:ERJ-2GEJ620X; Vendor_Part_Number: P62JCT-ND; ID: 108; Working_Voltage: 2.49; Watts: 0.1; Component: ERJ-2GEJ620X; Misfit Price: 0; Vendor: Digikey; Vendor_Qty_Avail: 92868; High_Price: 0.00248; Low_Price: 0.00218; Size_Metric: 1005; Voltage_Str: 2.49V; Watts_Str: 0.1W; Current_Str: A; Company_Part_GUID: altiumdb4ee8db66171e85.29075115; Value: 62; Ohms: 62; Size: 0402 (1005 Metric); Manufacturer_Part_Number: ERJ-2GEJ620X; Created_Date: 12/14/2011; ComponentLink1Description: Digikey; ComponentLink2Description: Datasheet; ComponentLink1URL: http://search.digikey.com/us/en/products/ERJ-2GEJ620X/P62JCT-ND/147051; ComponentLink2URL: http://industrial.panasonic.com/www-cgi/jvcr13pz.cgi?E+PZ+3+AOA0001+ERJ2GEJ620X+7+WW; Vendor_Part_URL: http://search.digikey.com/us/en/products/ERJ-2GEJ620X/P62JCT-ND/147051; Vendor_Update_Date: 4/26/2012; Price: 0.00218; Vendor_Unit_Price: 0.1
R5 R11 R17 R25 = altiumdb4ee8d954352e90.32802196: RES 0402 TKF 2.7K 5% 1/16W; Manufacturer_Part_Number: CRCW04022K70JNED; Manufacturer: Vishay/Dale; Old Part Number: 4530-0294-00; Manufacture_Parts: Yageo:RC0402JR-072K7L / Rohm Semiconductor:MCR01MZPJ272 / Vishay/Dale:CRCW04022K70JNED; Vendor_Part_Number: 541-2.7KJTR-ND; ID: 44; Working_Voltage: 13.04; Watts: 0.063; Ohms: 2700; Component: RC0402JR-072K7L; Misfit Price: 0; Vendor: Digikey; Vendor_Qty_Avail: 90000; High_Price: 0.0013; Low_Price: 0.00103; Size_Metric: 1005; Voltage_Str: 13.04V; Watts_Str: 0.063W; Current_Str: A; Vendor_Unit_Price: 0.012; Vendor_Packaging: Cut Tape (CT); Company_Part_GUID: altiumdb4ee8d954352e90.32802196; Value: 2.7K; Size: 0402 (1005 Metric); Created_Date: 12/14/2011; ComponentLink1Description: Digikey; ComponentLink2Description: Datasheet; ComponentLink1URL: http://search.digikey.com/us/en/products/CRCW04022K70JNED/541-2.7KJTR-ND/1177578; ComponentLink2URL: http://www.yageo.com/documents/recent/PYu-RC0402_51_RoHS_L_6.pdf; Vendor_Part_URL: http://search.digikey.com/us/en/products/CRCW04022K70JNED/541-2.7KJTR-ND/1177578; Vendor_Update_Date: 4/26/2012; Price: 0.00103; Vendor_Part_GUID: altiumdb4ee8d958511d75.53123930
R6 R7 R10 R13 R16 R18-R24 = altiumdb4ee8d91004d206.86276960: RES 0402 TKF 1K 1% 1/16W; Manufacturer: Yageo; Misfit Part Number: 00017-124-10045; Old Part Number: 4530-0548-00; Manufacture_Parts: Yageo:RC0402FR-071KL / Vishay/Dale:CRCW04021K00FKED; Vendor_Part_Number: 311-1.00KLRTR-ND; ID: 37; Working_Voltage: 7.94; Working_Current: 0; Watts: 0.063; Ohms: 1000; Component: RC0402FR-071KL; Misfit Price: 0.0011; Vendor: Digikey; Vendor_Qty_Avail: 1050000; High_Price: 0.00149; Low_Price: 0.00117; Size_Metric: 1005; Voltage_Str: 7.94V; Watts_Str: 0.063W; Current_Str: A; Temp_Coeff: 100ppm/C; Vendor_Unit_Price: 0.014; Vendor_Packaging: Cut Tape (CT); Company_Part_GUID: altiumdb4ee8d91004d206.86276960; Value: 1K; Size: 0402 (1005 Metric); Manufacturer_Part_Number: RC0402FR-071KL; Created_Date: 12/14/2011; ComponentLink1Description: Digikey; ComponentLink2Description: Datasheet; ComponentLink1URL: http://search.digikey.com/us/en/products/CRCW04021K00FKED/541-1.00KLTR-ND/1178007; ComponentLink2URL: http://www.vishay.com/doc?20035; Vendor_Part_URL: http://search.digikey.com/us/en/products/RC0402FR-071KL/311-1.00KLRTR-ND/726513; Vendor_Update_Date: 12/14/2011; Voltage: 0; Price: 0.0011; Vendor_Part_GUID: altiumdb4ee8d913581708.78919791
R8 = altiumdb4ee8d7ca229494.79847454: RES 0402 TKF 0R JMPR 1/16W; Manufacturer: Yageo; Misfit Part Number: 00017-126-00006; Old Part Number: 4530-0273-00; Manufacture_Parts: Yageo:RC0402JR-070RL / Rohm Semiconductor:MCR01MZPJ000 / VISHAY:CRCW04020000Z0EA / SAMSUNG:RC1005J000CS / KOA:RM73B1E000J / VISHAY:CRCW0402-000JRT7; Vendor_Part_Number: 311-0.0JRCT-ND; ID: 4; Working_Voltage: 0.00; Watts: 0.063; Ohms: 1E-5; Component: RC0402JR-070RL; Misfit Price: 0; Vendor: Digikey; Vendor_Qty_Avail: 1480650; High_Price: 0.0013; Low_Price: 0.00103; Size_Metric: 1005; Voltage_Str: 0.00V; Watts_Str: 0.063W; Current_Str: A; Vendor_Unit_Price: 0.012; Vendor_Packaging: Cut Tape (CT); Company_Part_GUID: altiumdb4ee8d7ca229494.79847454; Value: 0.0; Size: 0402 (1005 Metric); Manufacturer_Part_Number: RC0402JR-070RL; Created_Date: 12/14/2011; ComponentLink1Description: Digikey; ComponentLink2Description: Datasheet; ComponentLink1URL: http://search.digikey.com/us/en/products/RC0402JR-070RL/311-0.0JRCT-ND/729353; ComponentLink2URL: http://www.yageo.com/documents/recent/PYu-RC0402_51_RoHS_L_6.pdf; Vendor_Part_URL: http://search.digikey.com/us/en/products/RC0402JR-070RL/311-0.0JRCT-ND/729353; Vendor_Update_Date: 4/26/2012; Price: 0.00103; Vendor_Part_GUID: altiumdb4ee8d7c9da8dd2.85804149
R9 R14 R15#1 R15#2 = altiumdb4ee8d84e4aebe1.92806798: RES 0402 TKF 10K 1% 1/16W; Manufacturer_Part_Number: RC0402FR-0710KL; Manufacturer: Yageo; Misfit Part Number: 00017-124-10055; Manufacture_Parts: Vishay/Dale:CRCW040210K0FKED / KOA:RK73H1ETTP1002F / Panasonic - ECG:ERJ-2RKF1002X / Yageo:RC0402FR-0710KL / Rohm Semiconductor:MCR01MZPF1002; Vendor_Part_Number: 311-10.0KLRTR-ND; ID: 15; Working_Voltage: 25.10; Watts: 0.063; Ohms: 10000; Component: CRCW040210K0FKED; Misfit Price: 0; Vendor: Digikey; Vendor_Qty_Avail: 2670000; High_Price: 0.005; Low_Price: 0.003; Size_Metric: 1005; Voltage_Str: 25.10V; Watts_Str: 0.063W; Current_Str: A; Vendor_Unit_Price: 0.1; Vendor_Packaging: Cut Tape (CT); Company_Part_GUID: altiumdb4ee8d84e4aebe1.92806798; Value: 10K; Size: 0402 (1005 Metric); Created_Date: 12/14/2011; ComponentLink1Description: Digikey; ComponentLink2Description: Datasheet; ComponentLink1URL: http://search.digikey.com/us/en/products/RC0402FR-0710KL/311-10.0KLRTR-ND/726523; ComponentLink2URL: http://www.vishay.com/doc?20035; Vendor_Part_URL: http://search.digikey.com/us/en/products/RC0402FR-0710KL/311-10.0KLRTR-ND/726523; Vendor_Update_Date: 4/26/2012; Price: 0.003; Vendor_Part_GUID: altiumdb4ee8d855b09b52.43931841
R12 = altiumdb4ee8dafd4025b2.04113444: RES 0402 TKF 5.1K 5% 1/16W; Manufacturer: Rohm Semiconductor; Old Part Number: 4530-0295-00; Manufacture_Parts: Rohm Semiconductor:MCR01MZPJ512; Vendor_Part_Number: RHM5.1KJCT-ND; ID: 90; Working_Voltage: 17.92; Watts: 0.063; Ohms: 5100; Component: MCR01MZPJ512; Misfit Price: 0; Vendor: Digikey; Vendor_Qty_Avail: 2; High_Price: 0.00198; Low_Price: 0.00156; Size_Metric: 1005; Voltage_Str: 17.92V; Watts_Str: 0.063W; Current_Str: A; Vendor_Unit_Price: 0.018; Vendor_Packaging: Cut Tape (CT); Company_Part_GUID: altiumdb4ee8dafd4025b2.04113444; Value: 5.1K; Size: 0402 (1005 Metric); Manufacturer_Part_Number: MCR01MZPJ512; Created_Date: 12/14/2011; ComponentLink1Description: Digikey; ComponentLink2Description: Datasheet; ComponentLink1URL: http://search.digikey.com/us/en/products/MCR01MZPJ512/RHM5.1KJCT-ND/628304; ComponentLink2URL: http://www.rohm.com/products/databook/r/pdf/mcr01.pdf; Vendor_Part_URL: http://search.digikey.com/us/en/products/MCR01MZPJ512/RHM5.1KJCT-ND/628304; Vendor_Update_Date: 4/26/2012; Price: 0.00156; Vendor_Part_GUID: altiumdb4ee8dafce330f1.86486314
SW1 = altiumdb5720ffb537d454.34298613: Manufacture_Parts: :KMR231NG LFS; ID: 15; Misfit Price: 0; Vendor: unknown; Voltage_Str: 0V; Watts_Str: 0W; Current_Str: A; Company_Part_GUID: altiumdb5720ffb537d454.34298613; Component: KMR231NG LFS; Manufacturer_Part_Number: KMR231NG LFS; ComponentLink1Description: unknown; ComponentLink2Description: Datasheet; Voltage: 0; Watts: 0; Price: 0
SW2 = altiumdb59a6a8d097ed02.25158302: Rt Angle tactile push button; Manufacture_Parts: :Tactile_Rt_angle; ID: 24; Misfit Price: 0; Vendor: unknown; Voltage_Str: 0V; Watts_Str: 0W; Current_Str: A; Company_Part_GUID: altiumdb59a6a8d097ed02.25158302; Component: Tactile_Rt_angle; Manufacturer_Part_Number: Tactile_Rt_angle; ComponentLink1Description: unknown; ComponentLink2Description: Datasheet; Voltage: 0; Watts: 0; Price: 0
U1 = altiumdb5b1598557bfc18.812064: 48-V, 2.5-A BIPOLAR STEPPER OR MOTOR DRIVER; Manufacture_Parts: TI:DRV8434PRGER; ID: 96; Misfit Price: 0; Voltage_Str: 0V; Watts_Str: 0W; Current_Str: A; Company_Part_GUID: altiumdb5b1598557bfc18.812064; Component: DRV8434PRGER; Manufacturer_Part_Number: DRV8434PRGER; Voltage: 0; Watts: 0; Price: 0
U2 = altiumdb5720cf6a19f4d8.7656: Manufacture_Parts: :ATSAME51J20A; ID: 19; Misfit Price: 0; Vendor: unknown; Voltage_Str: 0V; Watts_Str: 0W; Current_Str: A; Company_Part_GUID: altiumdb5720cf6a19f4d8.7656; Component: ATSAME51J19A-MU; Manufacturer_Part_Number: ATSAME51J19A-MU; ComponentLink1Description: unknown; ComponentLink2Description: Datasheet; Voltage: 0; Watts: 0; Price: 4
U3 = altiumdb4f9183a00484d4.75542185: IC REG LINEAR 3.3V 150MA SOT23-5 iq=29uA; Manufacturer: Microchop; Misfit Part Number: 00012-001-427778; Manufacture_Parts: Microchip:MIC5225-3.3YM5-TR; ID: 27; Misfit Price: 0; Vendor_Qty_Avail: 3590; High_Price: 0.65; Low_Price: 0.2106; Size_Imperial: SC-74A, SOT-753; Voltage_Str: 0V; Watts_Str: 0W; Current_Str: A; Company_Part_GUID: altiumdb4f9183a00484d4.75542185; Component: MIC5225-3.3YM5-TR; Manufacturer_Part_Number: MIC5225-3.3YM5-TR; Created_Date: 4/20/2012; Vendor_Update_Date: 4/20/2012; Size: SC-74A, SOT-753; Size_Metric: SC-74A, SOT-753; Voltage: 0; Watts: 0; Price: 0.2106; Vendor_Unit_Price: 0.65
U4 = altiumdb4f86f13fa18df9.2021: 3-V TO 65-V, 0.6-A BUCK CONVERTER; Manufacturer: TI; Manufacture_Parts: TI:LMR36506MSCQRPERQ1; ID: 62; Misfit Price: 0; Vendor_Qty_Avail: 51000; High_Price: 2.61; Voltage_Str: 0V; Watts_Str: 0W; Current_Str: A; Vendor_Packaging: Cut Tape (CT); Company_Part_GUID: altiumdb4f86f13fa18df9.2021; Component: LMR36506MSCQRPERQ1; Manufacturer_Part_Number: LMR36506MSCQRPERQ1; Created_Date: 4/19/2012; Vendor_Update_Date: 4/12/2012; Low_Price: 2.61; Voltage: 0; Watts: 0; Price: 2.61; Vendor_Unit_Price: 2.61
U5 = altiumdb506c612ca2ae40.60197528: TVS Diode Arrays ESD Protection Low Cap; Manufacturer: STMicroelectronics; Manufacture_Parts: STMicroelectronics:USBLC6-2SC6; Vendor_Part_Number: 511-USBLC6-2SC6; ID: 9; Misfit Price: 0; Vendor: Mouser; Vendor_Qty_Avail: 50249; High_Price: 0.67; Low_Price: 0.321; Size_Imperial: SOT-23-6; Voltage_Str: 0V; Watts_Str: 0W; Current_Str: A; Company_Part_GUID: altiumdb506c612ca2ae40.60197528; Component: USBLC6-2SC6; Manufacturer_Part_Number: USBLC6-2SC6; Created_Date: 10/3/2012; ComponentLink1Description: Mouser; ComponentLink2Description: Datasheet; ComponentLink1URL: http://www.mouser.com/Search/Refine.aspx?N=4294764375&amp;Keyword=511-USBLC6-2SC6; ComponentLink2URL: http://www.st.com/internet/com/TECHNICAL_RESOURCES/TECHNICAL_LITERATURE/DATASHEET/CD00050750.pdf; Vendor_Part_URL: http://www.mouser.com/Search/Refine.aspx?N=4294764375&Keyword=511-USBLC6-2SC6; Vendor_Update_Date: 10/3/2012; Size: SOT-23-6; Size_Metric: SOT-23-6; Voltage: 0; Watts: 0; Price: 0.321
U6 = altiumdb5786b44c08eb91.84503477: Manufacture_Parts: :AS5047D; ID: 37; Misfit Price: 0; Vendor: unknown; Voltage_Str: 0V; Watts_Str: 0W; Current_Str: A; Company_Part_GUID: altiumdb5786b44c08eb91.84503477; Component: AS5047D; Manufacturer_Part_Number: AS5047D; ComponentLink1Description: unknown; ComponentLink2Description: Datasheet; Voltage: 0; Watts: 0; Price: 0
USB1 = altiumdb561d4bc7e25b70.41497989: Connector Receptacle USB - micro B 2.0 5 Position Surface Mount, Right Angle, Horizontal; Manufacturer: FCI; Manufacture_Parts: FCI:10118194-0001LF; Vendor_Part_Number: 609-4618-6-ND; ID: 45; Misfit Price: 0; Vendor: Digikey; High_Price: 0.46; Low_Price: 0.14625; Voltage_Str: 0V; Watts_Str: 0W; Current_Str: A; Company_Part_GUID: altiumdb561d4bc7e25b70.41497989; Component: 10118194-0001LF; Manufacturer_Part_Number: 10118194-0001LF; Created_Date: 10/13/2015; ComponentLink1Description: Digikey; ComponentLink2Description: Datasheet; ComponentLink1URL: http://www.digikey.com/product-detail/en/10118194-0001LF/609-4618-6-ND/2785383; ComponentLink2URL: http://portal.fciconnect.com/Comergent//fci/drawing/10118194.pdf; Vendor_Part_URL: http://www.digikey.com/product-detail/en/10118194-0001LF/609-4618-6-ND/2785383; Vendor_Update_Date: 10/13/2015; Voltage: 0; Watts: 0; Price: 0.14625
Y1 = altiumdb5018268f58fb89.22462782: CRYSTAL 32.7680KHZ 12.5PF SMD; Manufacturer: Micro Crystal; Misfit Part Number: 00012-001-47041; Manufacture_Parts: Micro Crystal:CM7V-T1A 32.768kHz 12.5pF 20ppm / Epson Toyocom Corporation:FC-135 32.7680KA-A3 / Micro Crystal:CC7V-T1A 32.768kHz 12.5pF 20ppm; Vendor_Part_Number: SE2413TR-ND; ID: 5; Operating_Temp: -40Â°C ~ 85Â°C; Misfit Price: 0.15; Vendor: unknown; Vendor_Qty_Avail: 46500; High_Price: 1.7; Low_Price: 1.02; Size_Imperial: 2-SMD; Voltage: 0; Voltage_Str: 0V; Watts_Str: 0W; Current_Str: A; Company_Part_GUID: altiumdb5018268f58fb89.22462782; Size: 2-SMD; Component: CM7V-T1A 32.768kHz 12.5pF 20ppm; Manufacturer_Part_Number: CM7V-T1A 32.768kHz 12.5pF 20ppm; Created_Date: 12/14/2011; ComponentLink1Description: Digikey; ComponentLink2Description: Datasheet; ComponentLink1URL: http://search.digikey.com/us/en/products/FC-135%2032.7680KA-A3/SE2413TR-ND/569818; ComponentLink2URL: http://www.eea.epson.com/portal/pls/portal/docs/1/1349455.PDF; Vendor_Part_URL: http://search.digikey.com/us/en/products/FC-135%2032.7680KA-A3/SE2413TR-ND/569818; Vendor_Update_Date: 12/14/2011; Value: CM7V-T1A 32.768kHz 12.5pF 20ppm; Size_Metric: 2-SMD; Watts: 0; Price: 0.15